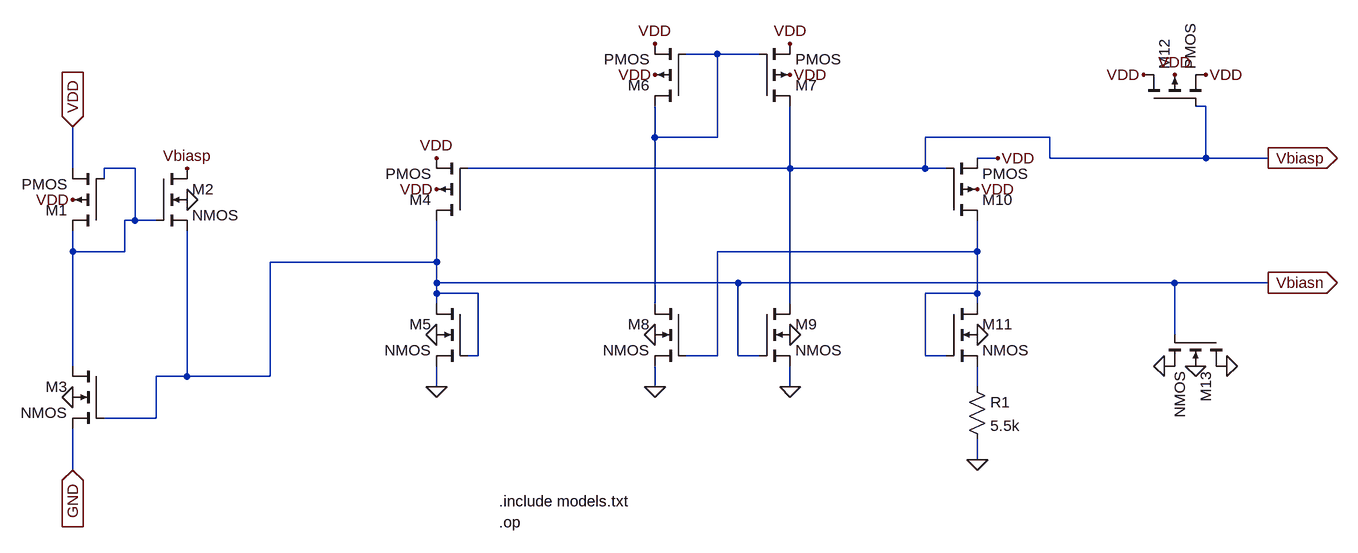
[diagram p0: schematic Comparator_bias.asc]
Comparator_bias.asc, the LTspice schematic file:
Version 4
SHEET 1 1992 864
WIRE 1008 -80 960 -80
WIRE 1072 -80 1008 -80
WIRE 1760 0 1744 0
WIRE 912 48 912 0
WIRE 1008 48 1008 -80
WIRE 1008 48 912 48
WIRE 1520 48 1328 48
WIRE 1440 80 1408 80
WIRE 1520 80 1520 48
WIRE 1760 80 1760 0
WIRE 1760 80 1520 80
WIRE 1856 80 1760 80
WIRE 16 96 16 32
WIRE 112 96 64 96
WIRE 1120 96 1120 0
WIRE 1120 96 624 96
WIRE 1328 96 1328 48
WIRE 1328 96 1120 96
WIRE 1360 96 1328 96
WIRE 64 112 64 96
WIRE 112 176 112 96
WIRE 112 176 96 176
WIRE 144 176 112 176
WIRE 16 224 16 192
WIRE 96 224 96 176
WIRE 96 224 16 224
WIRE 1408 224 1408 176
WIRE 1408 224 1008 224
WIRE 576 240 576 176
WIRE 576 240 320 240
WIRE 576 272 576 240
WIRE 1040 272 576 272
WIRE 1712 272 1040 272
WIRE 1856 272 1712 272
WIRE 576 288 576 272
WIRE 640 288 576 288
WIRE 1408 288 1408 224
WIRE 1408 288 1328 288
WIRE 576 304 576 288
WIRE 912 304 912 48
WIRE 1120 304 1120 96
WIRE 1408 304 1408 288
WIRE 1712 352 1712 272
WIRE 640 384 640 288
WIRE 640 384 624 384
WIRE 1008 384 1008 224
WIRE 1008 384 960 384
WIRE 1040 384 1040 272
WIRE 1072 384 1040 384
WIRE 1328 384 1328 288
WIRE 1360 384 1328 384
WIRE 16 400 16 224
WIRE 192 416 192 192
WIRE 192 416 144 416
WIRE 320 416 320 240
WIRE 320 416 192 416
WIRE 576 432 576 400
WIRE 912 432 912 400
WIRE 1120 432 1120 400
WIRE 1408 432 1408 400
WIRE 144 480 144 416
WIRE 144 480 64 480
WIRE 1408 544 1408 512
WIRE 16 560 16 496
FLAG 16 144 VDD
FLAG 192 144 0
FLAG 16 560 GND
IOPIN 16 560 In
FLAG 16 32 VDD
IOPIN 16 32 In
FLAG 192 96 Vbiasp
FLAG 576 432 0
FLAG 576 352 0
FLAG 576 128 VDD
FLAG 576 80 VDD
FLAG 912 -96 VDD
FLAG 1120 -96 VDD
FLAG 912 -48 VDD
FLAG 1120 -48 VDD
FLAG 912 432 0
FLAG 1120 432 0
FLAG 1408 544 0
FLAG 1856 80 Vbiasp
IOPIN 1856 80 Out
FLAG 1856 272 Vbiasn
IOPIN 1856 272 Out
FLAG 1440 80 VDD
FLAG 1664 -48 VDD
FLAG 1712 -48 VDD
FLAG 1760 -48 VDD
FLAG 1696 400 0
FLAG 1744 400 0
FLAG 1792 400 0
FLAG 912 352 0
FLAG 1120 352 0
FLAG 16 448 0
FLAG 1408 128 VDD
FLAG 1408 352 0
SYMBOL pmos4 64 192 R180
SYMATTR InstName M1
SYMATTR Value2 l=1u w=500n
SYMBOL nmos4 144 96 R0
SYMATTR InstName M2
SYMATTR Value2 l=50n w=500n
SYMBOL nmos4 64 400 M0
SYMATTR InstName M3
SYMATTR Value2 l=100n w=2.5u
SYMBOL pmos4 624 176 R180
SYMATTR InstName M4
SYMATTR Value2 l=100n w=5u
SYMBOL nmos4 624 304 M0
SYMATTR InstName M5
SYMATTR Value2 l=100n w=2.5u
SYMBOL pmos4 960 0 R180
SYMATTR InstName M6
SYMATTR Value2 l=100n w=5u
SYMBOL pmos4 1072 0 M180
SYMATTR InstName M7
SYMATTR Value2 l=100n w=5u
SYMBOL nmos4 960 304 M0
SYMATTR InstName M8
SYMATTR Value2 l=100n w=2.5u
SYMBOL nmos4 1072 304 R0
SYMATTR InstName M9
SYMATTR Value2 l=100n w=2.5u
SYMBOL pmos4 1360 176 M180
SYMATTR InstName M10
SYMATTR Value2 l=100n w=5u
SYMBOL nmos4 1360 304 R0
SYMATTR InstName M11
SYMATTR Value2 l=100n w=10u
SYMBOL res 1392 416 R0
SYMATTR InstName R1
SYMATTR Value 5.5k
SYMBOL pmos4 1664 0 R270
SYMATTR InstName M12
SYMATTR Value2 l=5u w=5u
SYMBOL nmos4 1792 352 R90
SYMATTR InstName M13
SYMATTR Value2 l=5u w=5u
TEXT 672 608 Left 2 !.include models.txt
TEXT 672 640 Left 2 !.op

The netlist it stands for:
* Comparator_bias.asc
M1 N002 N002 VDD VDD PMOS l=1u w=500n
M2 Vbiasp N002 Vbiasn 0 NMOS l=50n w=500n
M3 N002 Vbiasn GND 0 NMOS l=100n w=2.5u
M4 Vbiasn Vbiasp VDD VDD PMOS l=100n w=5u
M5 Vbiasn Vbiasn 0 0 NMOS l=100n w=2.5u
M6 N001 N001 VDD VDD PMOS l=100n w=5u
M7 Vbiasp N001 VDD VDD PMOS l=100n w=5u
M8 N001 N003 0 0 NMOS l=100n w=2.5u
M9 Vbiasp Vbiasn 0 0 NMOS l=100n w=2.5u
M10 N003 Vbiasp VDD VDD PMOS l=100n w=5u
M11 N003 N003 N004 0 NMOS l=100n w=10u
R1 N004 0 5.5k
M12 VDD Vbiasp VDD VDD PMOS l=5u w=5u
M13 0 Vbiasn 0 0 NMOS l=5u w=5u
.model NMOS NMOS
.model PMOS PMOS
.lib standard.mos
.include models.txt
.op
.backanno
.end